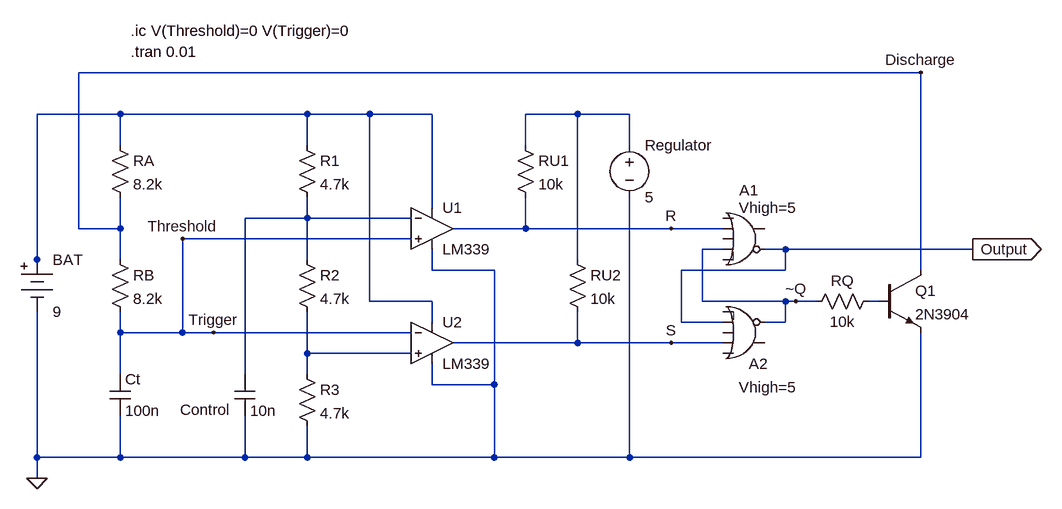
[diagram p0: schematic Astable Clock.asc]
Astable Clock.asc, the LTspice schematic file:
Version 4
SHEET 1 1620 816
WIRE 960 -64 -336 -64
WIRE -272 0 -400 0
WIRE 16 0 -272 0
WIRE 112 0 16 0
WIRE 208 0 112 0
WIRE 432 0 352 0
WIRE 512 0 432 0
WIRE -272 48 -272 0
WIRE 16 48 16 0
WIRE 352 48 352 0
WIRE 512 48 512 0
WIRE 208 144 208 0
WIRE 16 160 16 128
WIRE 16 160 -80 160
WIRE 176 160 16 160
WIRE -336 176 -336 -64
WIRE -272 176 -272 128
WIRE -272 176 -336 176
WIRE 352 176 352 128
WIRE 352 176 240 176
WIRE 576 176 352 176
WIRE 656 176 576 176
WIRE 176 192 -176 192
WIRE 656 208 624 208
WIRE 752 208 720 208
WIRE 1040 208 752 208
WIRE -400 224 -400 0
WIRE -272 224 -272 176
WIRE 16 224 16 160
WIRE 432 224 432 0
WIRE -400 240 -400 224
WIRE 208 240 208 208
WIRE 304 240 208 240
WIRE 752 240 752 208
WIRE 752 240 592 240
WIRE 960 240 960 -64
WIRE 112 288 112 0
WIRE 208 288 112 288
WIRE 624 288 624 208
WIRE 752 288 624 288
WIRE 768 288 752 288
WIRE 800 288 768 288
WIRE 896 288 880 288
WIRE 208 320 208 288
WIRE 592 320 592 240
WIRE 656 320 592 320
WIRE 752 320 752 288
WIRE 752 320 720 320
WIRE -272 336 -272 304
WIRE -176 336 -176 192
WIRE -176 336 -272 336
WIRE -128 336 -176 336
WIRE 176 336 -128 336
WIRE 432 352 432 304
WIRE 432 352 240 352
WIRE 576 352 432 352
WIRE 656 352 576 352
WIRE 16 368 16 304
WIRE 176 368 16 368
WIRE -272 400 -272 336
WIRE -80 400 -80 160
WIRE 16 400 16 368
WIRE 208 416 208 384
WIRE 304 416 304 240
WIRE 304 416 208 416
WIRE -400 528 -400 304
WIRE -272 528 -272 464
WIRE -272 528 -400 528
WIRE -80 528 -80 464
WIRE -80 528 -272 528
WIRE 16 528 16 480
WIRE 16 528 -80 528
WIRE 304 528 304 416
WIRE 304 528 16 528
WIRE 512 528 512 128
WIRE 512 528 304 528
WIRE 960 528 960 336
WIRE 960 528 512 528
WIRE -400 560 -400 528
FLAG -400 560 0
FLAG -176 192 Threshold
FLAG 576 176 R
FLAG 576 352 S
FLAG 960 -64 Discharge
FLAG 768 288 ~Q
FLAG 1040 208 Output
IOPIN 1040 208 Out
FLAG -128 336 Trigger
SYMBOL res 0 32 R0
SYMATTR InstName R1
SYMATTR Value 4.7k
SYMBOL res 0 208 R0
SYMATTR InstName R2
SYMATTR Value 4.7k
SYMBOL res 0 384 R0
SYMATTR InstName R3
SYMATTR Value 4.7k
SYMBOL res -288 32 R0
SYMATTR InstName RA
SYMATTR Value 8.2k
SYMBOL Misc\\battery -400 208 R0
SYMATTR InstName BAT
SYMATTR Value 9
SYMBOL cap -96 400 R0
WINDOW 0 -84 55 Left 2
SYMATTR InstName Control
SYMATTR Value 10n
SYMBOL npn 896 240 R0
SYMATTR InstName Q1
SYMATTR Value 2N3904
SYMBOL Digital\\or 688 128 R0
WINDOW 3 -8 16 Left 2
WINDOW 0 -7 -11 Left 2
SYMATTR Value Vhigh=5
SYMATTR InstName A1
SYMBOL Digital\\or 688 400 M180
WINDOW 3 -8 -20 Left 2
SYMATTR Value Vhigh=5
SYMATTR InstName A2
SYMBOL cap -288 400 R0
SYMATTR InstName Ct
SYMATTR Value 100n
SYMBOL res 784 304 R270
WINDOW 0 32 56 VTop 2
WINDOW 3 0 56 VBottom 2
SYMATTR InstName RQ
SYMATTR Value 10k
SYMBOL voltage 512 32 R0
SYMATTR InstName Regulator
SYMATTR Value 5
SYMBOL res 416 208 R0
SYMATTR InstName RU2
SYMATTR Value 10k
SYMBOL res 336 32 R0
SYMATTR InstName RU1
SYMATTR Value 10k
SYMBOL res -288 208 R0
SYMATTR InstName RB
SYMATTR Value 8.2k
SYMBOL LM339 208 112 R0
SYMATTR InstName U1
SYMBOL LM339 208 288 R0
SYMATTR InstName U2
TEXT -256 -96 Left 2 !.tran 0.01
TEXT -256 -128 Left 2 !.ic V(Threshold)=0 V(Trigger)=0

The netlist it stands for:
* Astable Clock.asc
R1 N001 N003 4.7k
R2 N003 N005 4.7k
R3 N005 0 4.7k
RA N001 Discharge 8.2k
V§BAT N001 0 9
Control N003 0 10n
Q1 Discharge N004 0 0 2N3904
A1 0 R 0 ~Q 0 Output 0 0 OR Vhigh=5
A2 0 S 0 Output 0 ~Q 0 0 OR Vhigh=5
Ct Trigger 0 100n
RQ ~Q N004 10k
V§Regulator N002 0 5
RU2 N002 S 10k
RU1 N002 R 10k
RB Discharge Trigger 8.2k
XU1 Trigger N003 N001 0 R LM339  ; pins In+ In- V+ V- OUT
XU2 N005 Trigger N001 0 S LM339  ; pins In+ In- V+ V- OUT
.model NPN NPN
.model PNP PNP
.lib standard.bjt
.tran 0.01
.ic V(Threshold)=0 V(Trigger)=0
.lib LM339.sub
.backanno
.end